# Altium schematic sheet COMS0005 RadioMux.SchDoc: BLUEsat Switching Circuit
size A3; Engineer: D. JEDRYCHOWSKI; Organization: BLUEsat Project; Address1: Room 419; Address2: School of EE&T; Address3: UNSW, NSW 2052; Address4: Australia; DocumentNumber: COMS0005; SheetNumber: 3; SheetTotal: 4; Description: Selects the transmitter and reciever radios to be used; Version: 1.0
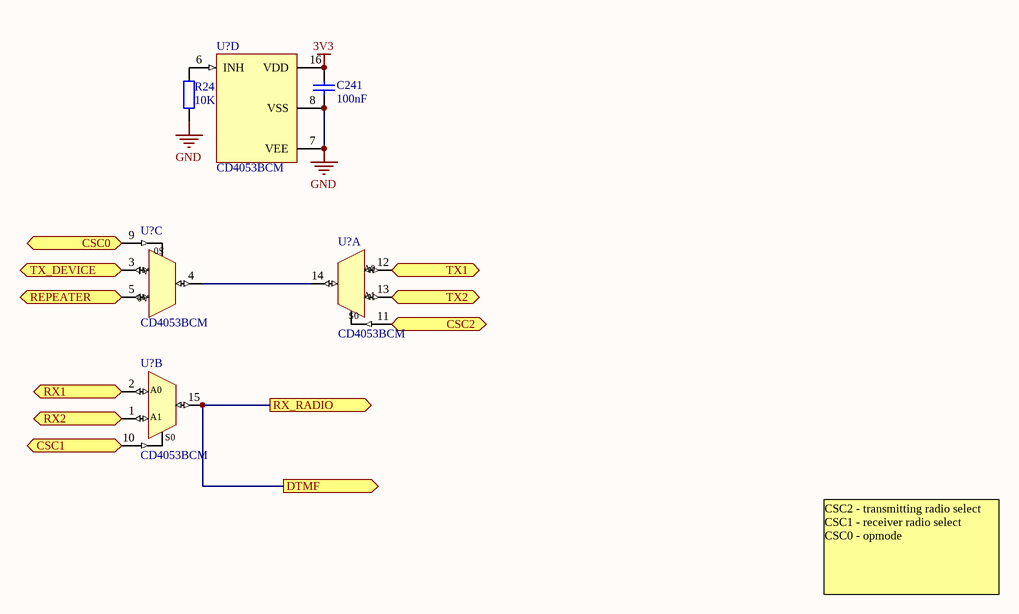
[diagram p0: COMS0005 RadioMux.SchDoc]

## Parts
(Parts that share a designator on the sheet are numbered #1, #2 ... from top to bottom, then left to right.)
C241  value 100nF  [CAP0603]  (hidden comment: Capacitor, ceramic)
R241  value 10K  [RES0603]  (hidden comment: Res1)
U?#1  CD4053BCM  [TSSOP16]  (part D of 4)
U?#2  CD4053BCM  [TSSOP16]  (part C of 4)
U?#3  CD4053BCM  [TSSOP16]  (part A of 4)
U?#4  CD4053BCM  [TSSOP16]  (part B of 4)

## Ports
CSC0 (in), CSC1 (in), CSC2 (in), DTMF (out), REPEATER (in), RX1 (in), RX2 (in), RX_RADIO (out), TX1 (out), TX2 (out), TX_DEVICE (in)

## Nets
3V3: C241.2 U?#1.16(VDD)
GND: C241.1 R241.2 U?#1.7(VEE) U?#1.8(VSS)
CSC0: U?#2.9(C) ; port CSC0
CSC1: U?#4.10(B) ; port CSC1
CSC2: U?#3.11(A) ; port CSC2
DTMF: U?#4.15(b_out) ; port RX_RADIO, port DTMF
REPEATER: U?#2.5(cx) ; port REPEATER
RX1: U?#4.2(bx) ; port RX1
RX2: U?#4.1(by) ; port RX2
TX1: U?#3.12(A0) ; port TX1
TX2: U?#3.13(A1) ; port TX2
TX_DEVICE: U?#2.3(cy) ; port TX_DEVICE
NetR241_1: R241.1 U?#1.6(INH)
NetU?#2_4: U?#2.4(c_out) U?#3.14(A_out)

## Notes on the sheet
- CSC2 - transmitting radio select
  CSC1 - receiver radio select
  CSC0 - opmode
- Title
- Description:
- Size:
- Author:
- Date:
- A3
- Time:
- Version
- Sheet:
- Drawing No.:
- of
- File:
- (in symbol CD4053BCM, part A) S0
- (in symbol CD4053BCM, part B) S0
- (in symbol CD4053BCM, part C) S0

## Library data of the parts
C241 = CAP0603: Capacitor; Supplier 1: Farnell; Supplier Product Range Link: http://au.element14.com/jsp/level5/module.jsp?moduleId=en/208437.xml
R241 = RES0603: Resistor; Supplier: Farnell; Supplier Order Number: *
U?#1-U?#4 = CD4053BCM: Triple 2-Channnel Analog Multiplexer/Demutiplexer; Supplier 1: Farnell; Supplier Part Number 1: 2132284